# EAGLE schematic BT_HC05 (EAGLE 7.6.0)
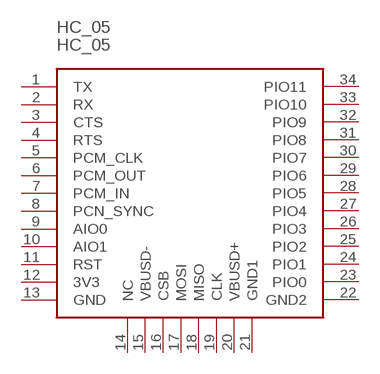
[diagram p0: schematic, sheet 1]

## Parts
HC_05  HC_05  [BLUETOOTH_SMD]
Unconnected: HC_05.1(TX) HC_05.2(RX) HC_05.3(CTS) HC_05.4(RTS) HC_05.5(PCM_CLK) HC_05.6(PCM_OUT) HC_05.7(PCM_IN) HC_05.8(PCN_SYNC) HC_05.9(AIO0) HC_05.10(AIO1) HC_05.11(RST) HC_05.12(3V3) HC_05.13(GND) HC_05.14(NC) HC_05.15(VBUSD-) HC_05.16(CSB) HC_05.17(MOSI) HC_05.18(MISO) HC_05.19(CLK) HC_05.20(VBUSD+) HC_05.21(GND1) HC_05.22(GND2) HC_05.23(PIO0) HC_05.24(PIO1) HC_05.25(PIO2) HC_05.26(PIO3) HC_05.27(PIO4) HC_05.28(PIO5) HC_05.29(PIO6) HC_05.30(PIO7) HC_05.31(PIO8) HC_05.32(PIO9) HC_05.33(PIO10) HC_05.34(PIO11)

## Library data of the parts
HC_05 = SerialPortBluetooth:HC_05